# EAGLE design lamp (EAGLE 9.1.0)
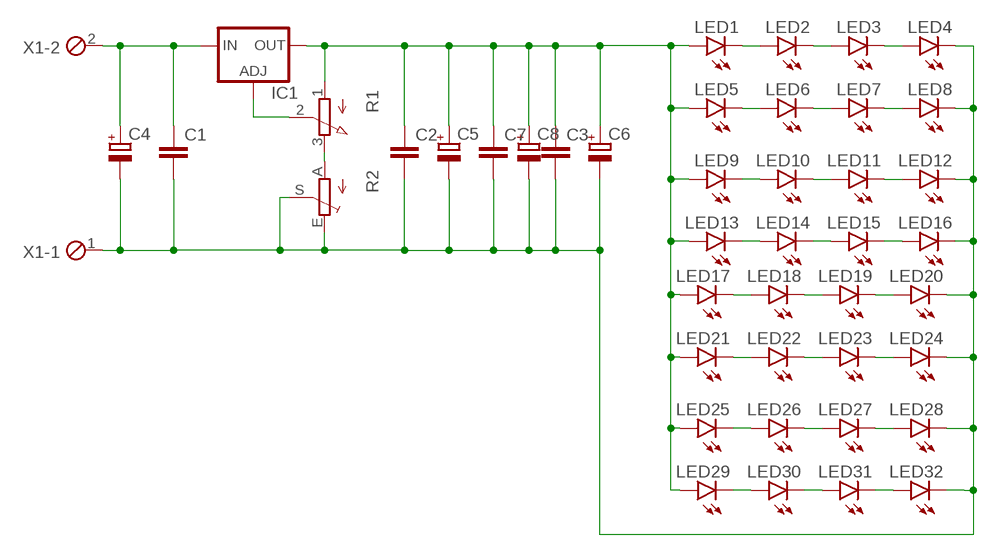
[diagram p0: schematic, sheet 1]

## Parts
C1  C-EU025-025X050  [C025-025X050]
C2  C-EU025-025X050  [C025-025X050]
C3  C-EU025-025X050  [C025-025X050]
C4  CPOL-EUE2-5  [E2-5]
C5  CPOL-EUE2-5  [E2-5]
C6  CPOL-EUE2-5  [E2-5]
C7  C-EU025-025X050  [C025-025X050]
C8  CPOL-EUE2-5  [E2-5]
IC1  LM317TS  [317TS]
LED1  LED3MM  [LED3MM]
LED2  LED3MM  [LED3MM]
LED3  LED3MM  [LED3MM]
LED4  LED3MM  [LED3MM]
LED5  LED3MM  [LED3MM]
LED6  LED3MM  [LED3MM]
LED7  LED3MM  [LED3MM]
LED8  LED3MM  [LED3MM]
LED9  LED3MM  [LED3MM]
LED10  LED3MM  [LED3MM]
LED11  LED3MM  [LED3MM]
LED12  LED3MM  [LED3MM]
LED13  LED3MM  [LED3MM]
LED14  LED3MM  [LED3MM]
LED15  LED3MM  [LED3MM]
LED16  LED3MM  [LED3MM]
LED17  LED3MM  [LED3MM]
LED18  LED3MM  [LED3MM]
LED19  LED3MM  [LED3MM]
LED20  LED3MM  [LED3MM]
LED21  LED3MM  [LED3MM]
LED22  LED3MM  [LED3MM]
LED23  LED3MM  [LED3MM]
LED24  LED3MM  [LED3MM]
LED25  LED3MM  [LED3MM]
LED26  LED3MM  [LED3MM]
LED27  LED3MM  [LED3MM]
LED28  LED3MM  [LED3MM]
LED29  LED3MM  [LED3MM]
LED30  LED3MM  [LED3MM]
LED31  LED3MM  [LED3MM]
LED32  LED3MM  [LED3MM]
R1  3RP/1610N  [3RP/1610N]
R2  TRIM_EU-CA6V  [CA6V]
X1  MPT2  [2POL254]

## Nets
GND: C1.2 C2.2 C3.2 C4.- C5.- C6.- C7.2 C8.- LED4.K(C) LED8.K(C) LED12.K(C) LED16.K(C) LED20.K(C) LED24.K(C) LED28.K(C) LED32.K(C) R2.E R2.S X1.1
N$1: LED1.K(C) LED2.A
N$2: LED2.K(C) LED3.A
N$3: LED3.K(C) LED4.A
N$4: LED5.K(C) LED6.A
N$5: LED6.K(C) LED7.A
N$6: LED7.K(C) LED8.A
N$7: LED9.K(C) LED10.A
N$8: LED10.K(C) LED11.A
N$9: LED11.K(C) LED12.A
N$10: LED15.K(C) LED16.A
N$11: LED14.K(C) LED15.A
N$12: LED13.K(C) LED14.A
N$13: C1.1 C4.+ IC1.3(IN) X1.2
N$15: IC1.1(ADJ) R1.2(S)
N$16: LED17.K(C) LED18.A
N$17: R1.3(E) R2.A
N$19: LED18.K(C) LED19.A
N$20: LED19.K(C) LED20.A
N$21: LED21.K(C) LED22.A
N$22: LED22.K(C) LED23.A
N$23: LED23.K(C) LED24.A
N$24: LED25.K(C) LED26.A
N$25: LED26.K(C) LED27.A
N$26: LED27.K(C) LED28.A
N$27: LED31.K(C) LED32.A
N$28: LED30.K(C) LED31.A
N$29: LED29.K(C) LED30.A
V+: C2.1 C3.1 C5.+ C6.+ C7.1 C8.+ IC1.2(OUT) LED1.A LED5.A LED9.A LED13.A LED17.A LED21.A LED25.A LED29.A R1.1(A)

## Library data of the parts
C1-C3 C7 = rcl:C-EU: CAPACITOR, European symbol; SPICEPREFIX: C
C4-C6 C8 = rcl:CPOL-EU: POLARIZED CAPACITOR, European symbol; SPICEPREFIX: C
IC1 = v-reg:LM317TS: VOLTAGE REGULATOR
LED1-LED32 = led:LED: LED OSRAM: - CHIPLED LG R971, LG N971, LY N971, LG Q971, LY Q971, LO R971, LY R971 LH N974, LH R974 LS Q976, LO Q976, LY Q976 LO Q996 - Hyper CHIPLED LW Q18S LB Q993, LB Q99A, LB R99A - SideLED LS A670, LO A670, LY A670, LG A670, LP A670 LB A673, LV A673, LT A673, LW A673 LH A674 LY A675 LS A676, LA A676, LO A676, LY A676, LW A676 LS A679, LY A679, LG A679 - Hyper Micro SIDELED® LS Y876, LA Y876, LO Y876, LY Y876 LT Y87S - SmartLED LW L88C, LW L88S LB L89C, LB L89S, LG L890 LS L89K, LO L89K, LY L89K LS L896, LA L896, LO L896, LY L896 - TOPLED LS T670, LO T670, LY T670, LG T670, LP T670 LSG T670, LSP T670, LSY T670, LOP T670, LYG T670 LG T671, LOG T671, LSG T671 LB T673, LV T673, LT T673, LW T673 LH T674 LS T676, LA T676, LO T676, LY T676, LB T676, LH T676, LSB T676, LW T676 LB T67C, LV T67C, LT T67C, LS T67K, LO T67K, LY T67K, LW E67C LS E67B, LA E67B, LO E67B, LY E67B, LB E67C, LV E67C, LT E67C LW T67C LS T679, LY T679, LG T679 LS T770, LO T770, LY T770, LG T770, LP T770 LB T773, LV T773, LT T773, LW T773 LH T774 LS E675, LA E675, LY E675, LS T675 LS T776, LA T776, LO T776, LY T776, LB T776 LHGB T686 LT T68C, LB T68C - Hyper Mini TOPLED® LB M676 - Mini TOPLED Santana® LG M470 LS M47K, LO M47K, LY M47K Source: http://www.osram.convergy.de LUXEON: - LUMILED® LXK2-PW12-R00, LXK2-PW12-S00, LXK2-PW14-U00, LXK2-PW14-V00 LXK2-PM12-R00, LXK2-PM12-S00, LXK2-PM14-U00 LXK2-PE12-Q00, LXK2-PE12-R00, LXK2-PE12-S00, LXK2-PE14-T00, LXK2-PE14-U00 LXK2-PB12-K00, LXK2-PB12-L00, LXK2-PB12-M00, LXK2-PB14-N00, LXK2-PB14-P00, LXK2-PB14-Q00 LXK2-PR12-L00, LXK2-PR12-M00, LXK2-PR14-Q00, LXK2-PR14-R00 LXK2-PD12-Q00, LXK2-PD12-R00, LXK2-PD12-S00 LXK2-PH12-R00, LXK2-PH12-S00 LXK2-PL12-P00, LXK2-PL12-Q00, LXK2-PL12-R00 Source: www.luxeon.com KINGBRIGHT: KA-3528ASYC Source: www.kingbright.com
R1 = pot:3RP/1610N: 16mm Potentiometer one level Source: http://www.alphapotentiometers.net/html/16mm_pot_2.html
R2 = pot:TRIM_EU-: POTENTIOMETER
X1 = con-phoenix-254:MPT2: PHOENIX CONNECTOR; OC_FARNELL: unknown; OC_NEWARK: unknown

## Board
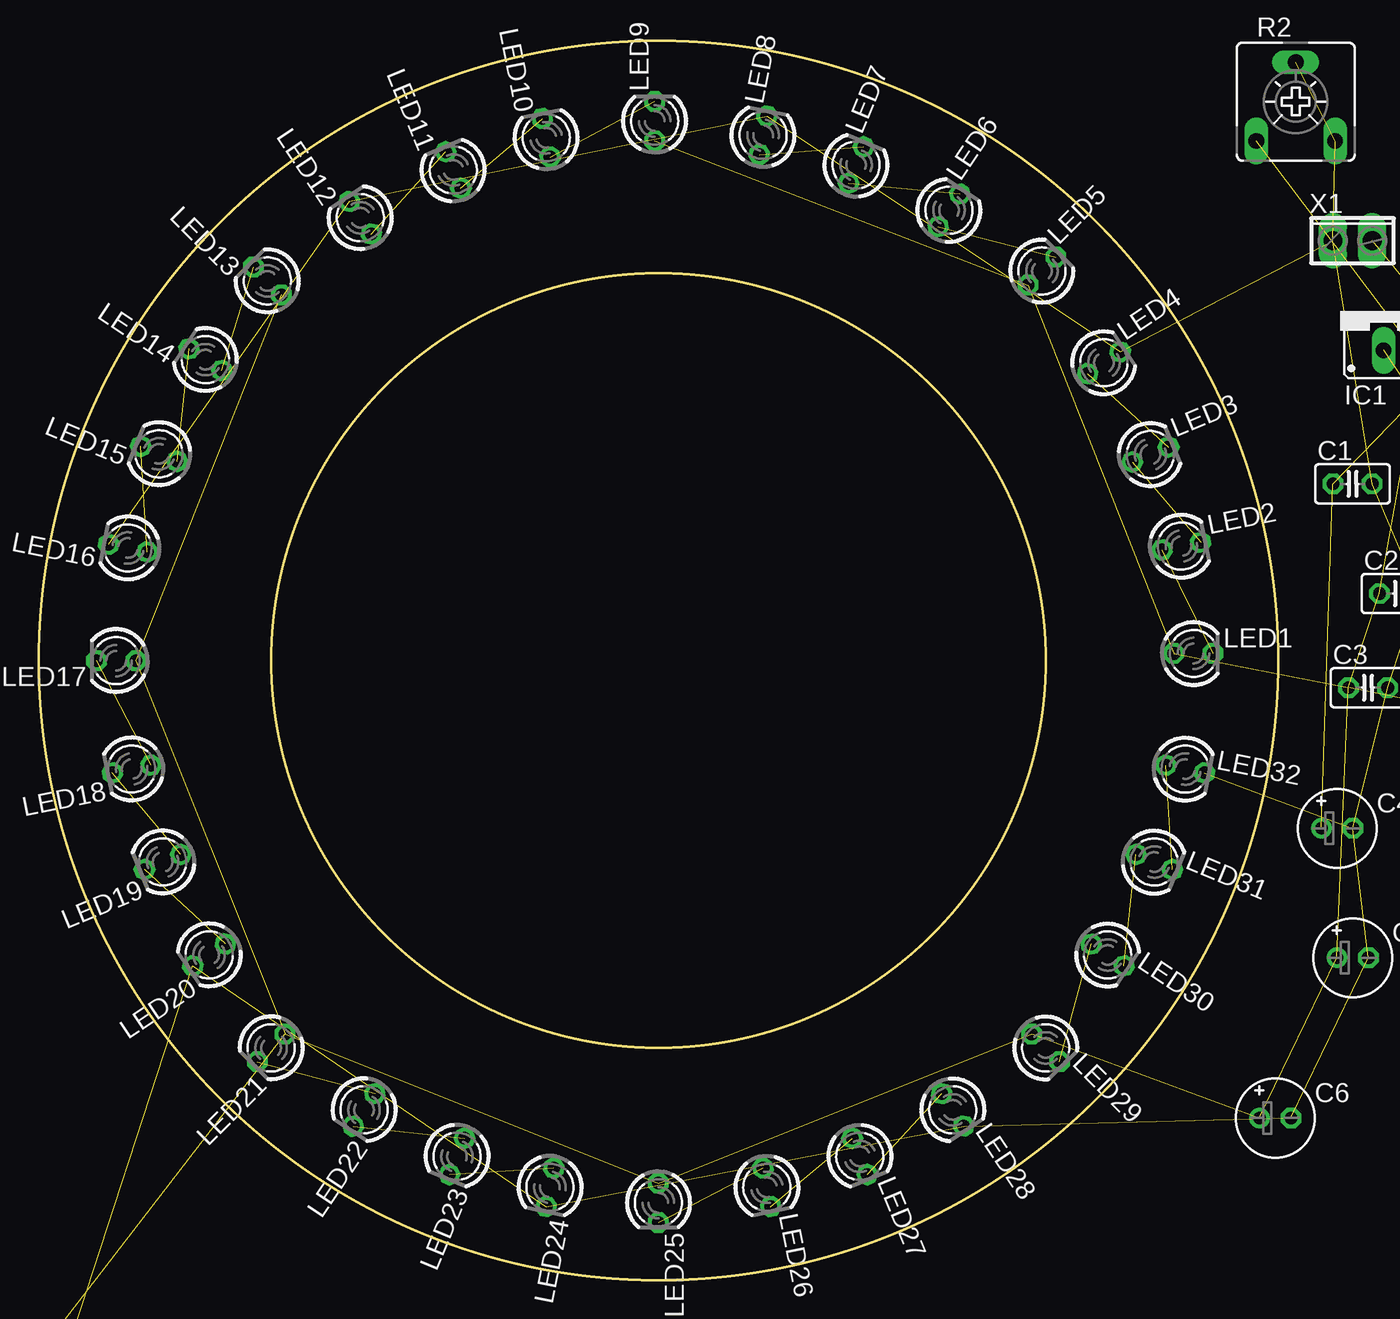
[diagram p1: board, top side]
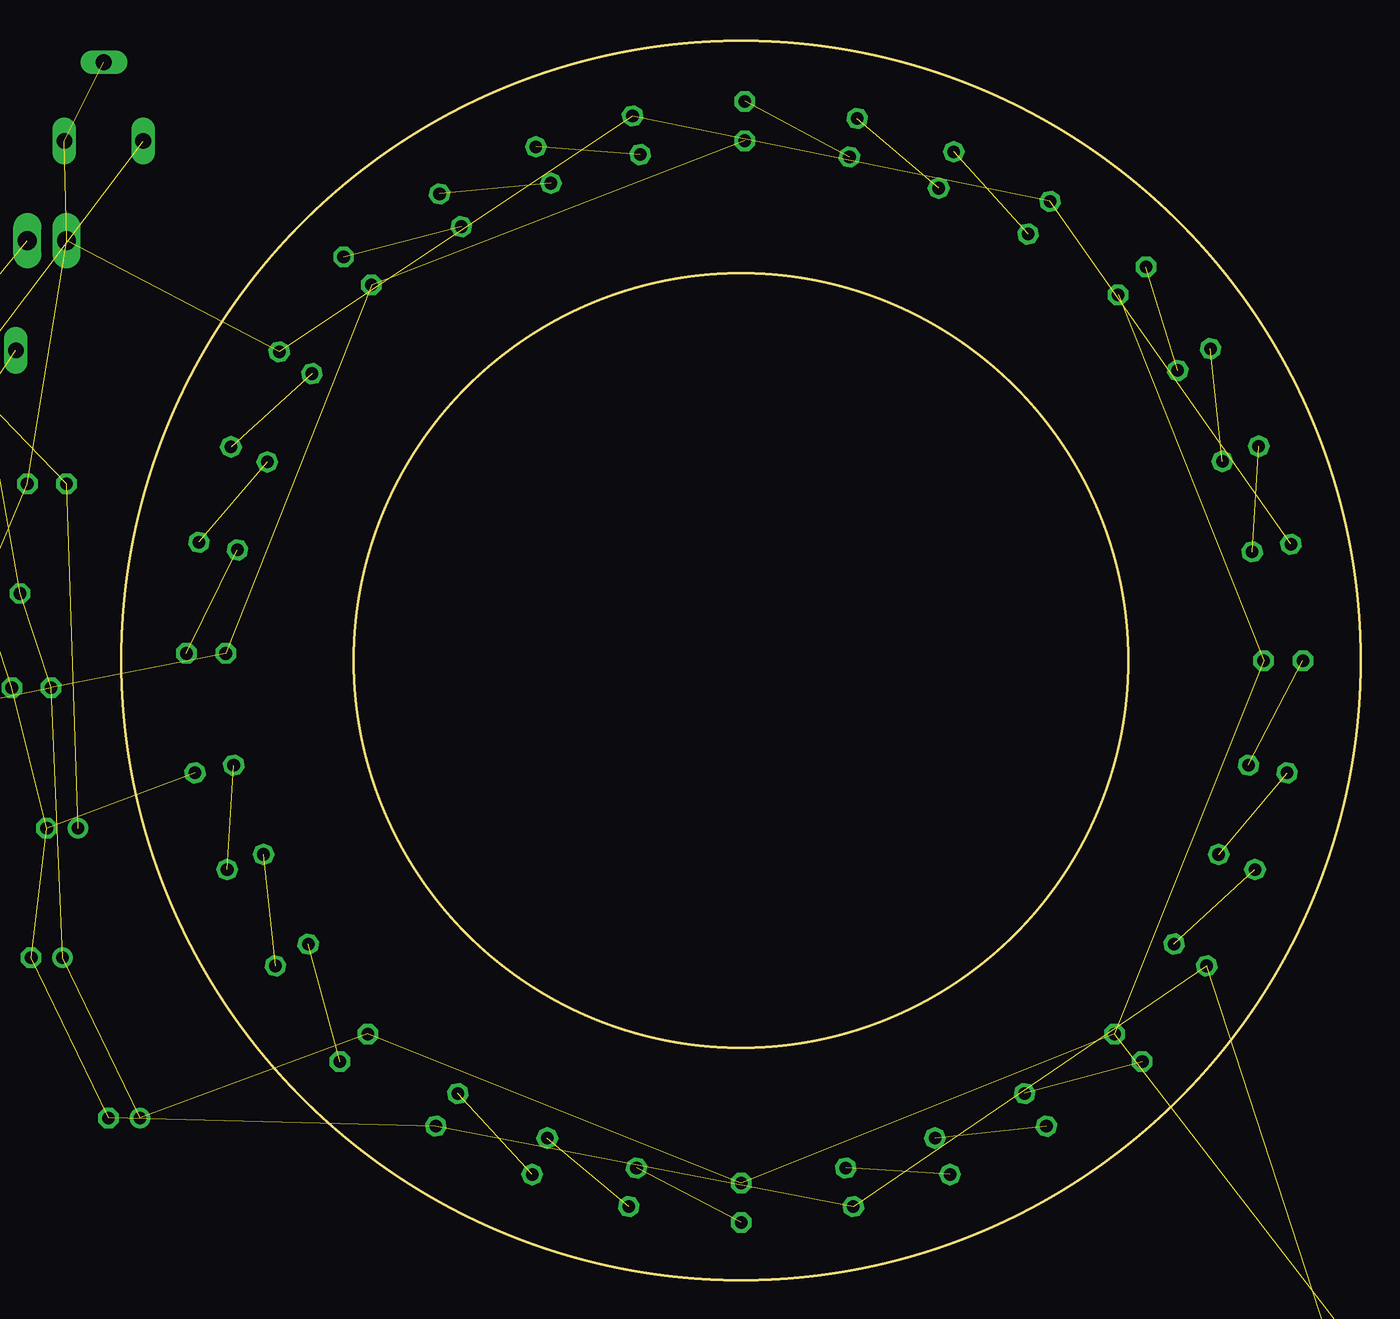
[diagram p2: board, bottom side, seen from below]

Size 80 x 80 mm. Coordinates in mm from the lower left corner, seen from the top.
Outline: circle at 40,40 radius 40
Outline: circle at 40,40 radius 25
Copper layers (1*16): Top 0.035mm / dielectric 1.5mm / Bottom 0.035mm
Design rules "default": minimum track width 6mil, minimum drill 0.35mm, track to track 6mil, track to pad 6mil, pad to pad 6mil, via to via 6mil, smd to smd 6mil, copper to edge 40mil, drill to drill 6mil, minimum pad ring 10mil, minimum via ring 8mil, stop-mask expansion 4mil, vias tented up to drill 0mil, thermal gap 10mil

### Footprints (pad centres in the part's own frame; a part is rotated, then mirrored left to right if it is on the bottom)
C025-025X050 = drill 0.813 octagon: 1 -1.27,0; 2 1.27,0
E2-5 = drill 0.813 pad 1.27: + -1.016,0 | drill 0.813 pad 1.27 octagon: - 1.016,0
317TS = drill 1.016 long: 1 -2.54,-2.54; 2 0,-2.54; 3 2.54,-2.54
LED3MM = drill 0.813 octagon: A -1.27,0; K 1.27,0
3RP/1610N = drill 1.2 pad 2.184: 1 -5,0; 2 0,0; 3 5,0
CA6V = drill 1.016 long: A -2.54,-2.54; E 2.54,-2.54; S 0,2.54
2POL254 = drill 1.2 long: 1 -1.27,0; 2 1.27,0

### Placement (x,y rotation side)
C1  84.81,51.41 0 top  (outside the outline)
C2  87.81,44.33 0 top  (outside the outline)
C3  85.81,38.25 0 top  (outside the outline)
C4  83.81,29.17 0 top
C5  84.81,20.82 0 top  (outside the outline)
C6  79.81,10.47 0 top
C7  0,-6.35 0 top  (outside the outline)
C8  0,-11.43 0 top  (outside the outline)
IC1  89.35,62.57 0 top  (outside the outline)
LED1  74.54,40.46 0 top
LED2  73.76,47.39 11.3 top
LED3  71.76,53.31 22.5 top
LED4  68.76,59.23 33.8 top
LED5  64.76,65.15 45 top
LED6  58.76,69.07 56.3 top
LED7  52.76,71.99 67.5 top
LED8  46.76,73.91 78.8 top
LED9  39.76,74.83 90 top
LED10  32.76,73.75 101.3 top
LED11  26.76,71.67 112.5 top
LED12  20.76,68.59 123.8 top
LED13  14.76,64.51 135 top
LED14  10.76,59.43 146.3 top
LED15  7.76,53.35 157.5 top
LED16  5.76,47.27 168.8 top
LED17  5,40 180 top
LED18  6,33 191.3 top
LED19  8,27 202.5 top
LED20  11,21 213.8 top
LED21  15,15 225 top
LED22  21,11 236.3 top
LED23  27,8 247.5 top
LED24  33,6 258.8 top
LED25  40,5 270 top
LED26  47,6 281.3 top
LED27  53,8 292.5 top
LED28  59,11 303.8 top
LED29  65,15 315 top
LED30  69,21 326.3 top
LED31  72,27 337.5 top
LED32  74,33 348.8 top
R1  100.1,40.11 90 top  (outside the outline)
R2  81.14,76.08 0 top
X1  84.81,67.11 0 top  (outside the outline)

### Tracks (layer width: path | path; a pad name or v marks a point on that pad's centre or on a via)
GND  (18 unrouted)
N$1  (1 unrouted)
  Bottom 1.016: 72.39,47.29 LED2.A
N$2  (1 unrouted)
N$3  (1 unrouted)
N$4  (1 unrouted)
N$5  (1 unrouted)
N$6  (1 unrouted)
N$7  (1 unrouted)
N$8  (1 unrouted)
N$9  (1 unrouted)
N$10  (1 unrouted)
N$11  (1 unrouted)
N$12  (1 unrouted)
N$13  (3 unrouted)
N$15  (1 unrouted)
N$16  (1 unrouted)
N$17  (1 unrouted)
N$19  (1 unrouted)
N$20  (1 unrouted)
N$21  (1 unrouted)
N$22  (1 unrouted)
N$23  (1 unrouted)
N$24  (1 unrouted)
N$25  (1 unrouted)
N$26  (1 unrouted)
N$27  (1 unrouted)
N$28  (1 unrouted)
N$29  (1 unrouted)
V+  (15 unrouted)